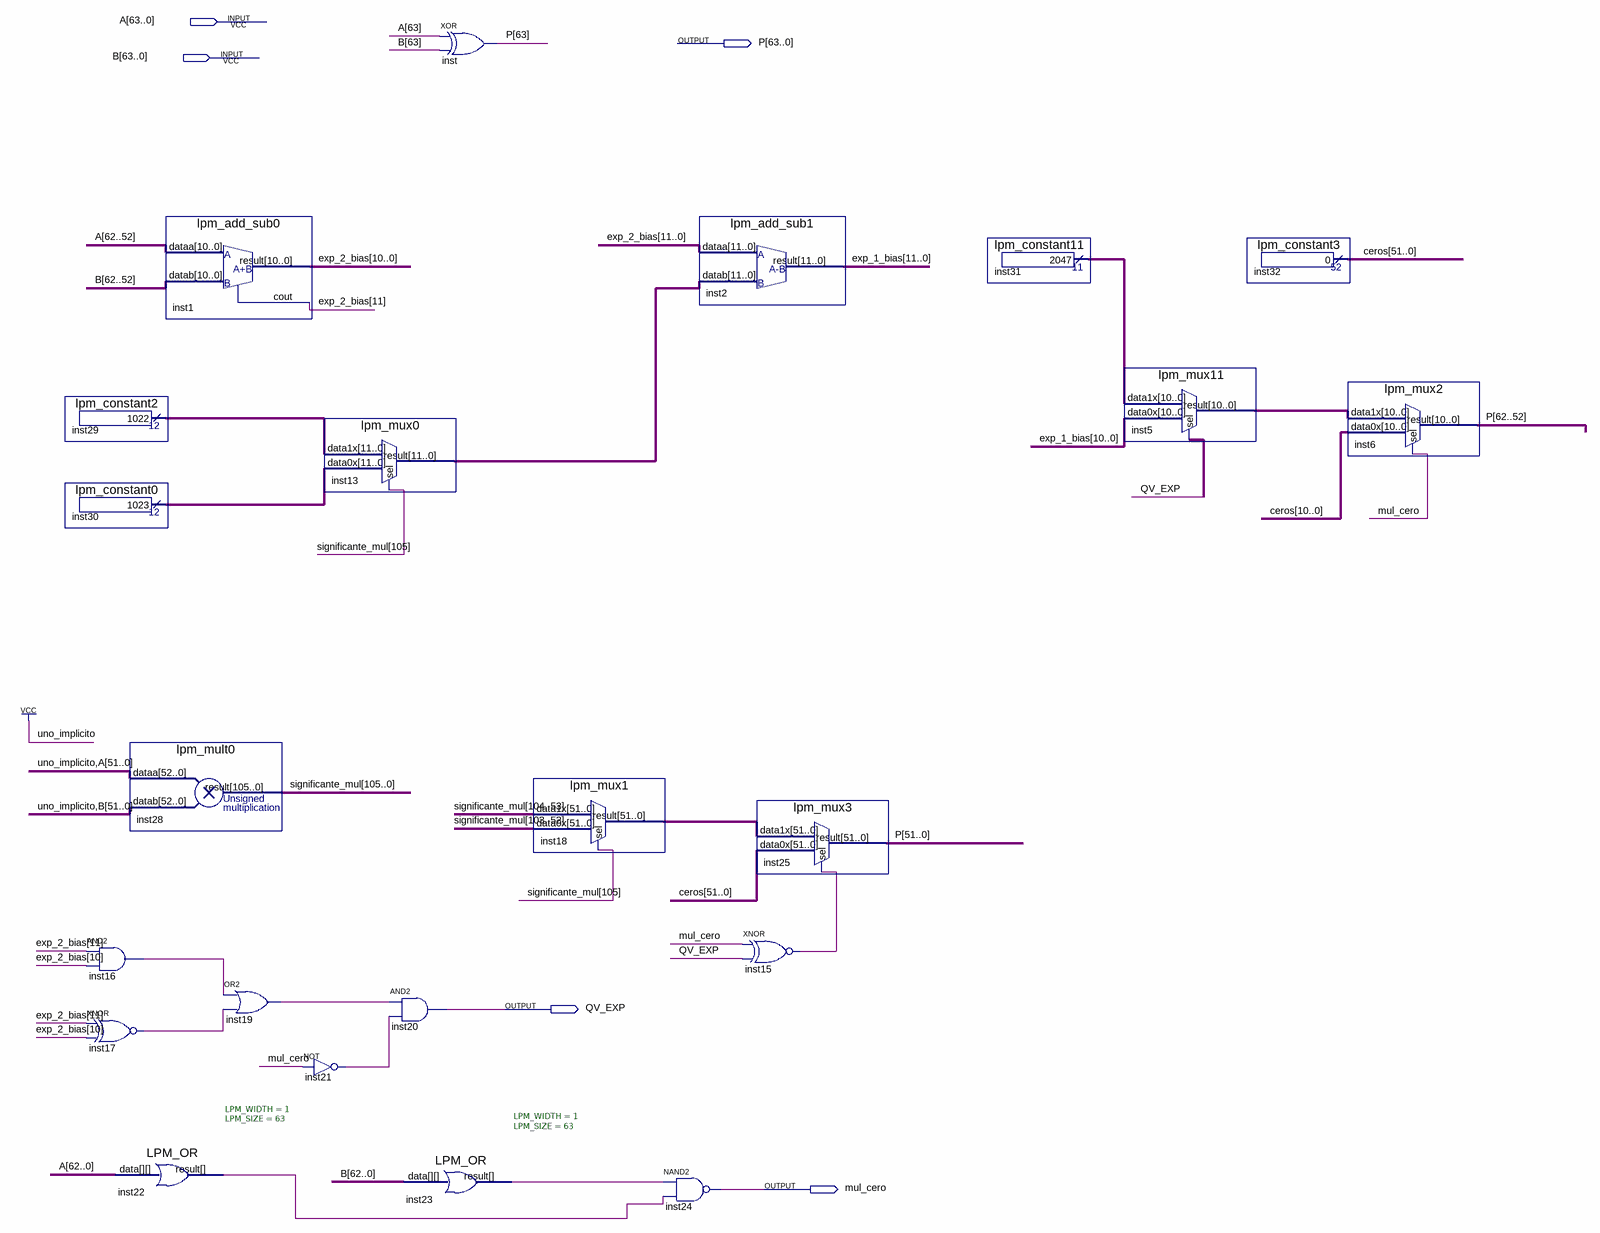
[diagram p0: schematic sheet]
// Quartus schematic multiplicador_combinacional_64bits.bdf as structural Verilog: 22 symbols, 5 pins
module multiplicador_combinacional_64bits (
  input  [63:0] A,
  input  [63:0] B,
  output [63:0] P,
  output QV_EXP,
  output mul_cero
);

  wire inst15_out, inst16_out, inst17_out, inst19_out, inst21_out, inst22_result, inst23_result, undriven;
  wire [10:0] inst5_result, inst31_result;
  wire [11:0] exp_1_bias, exp_2_bias, inst13_result, inst29_result, inst30_result;
  wire [51:0] ceros, inst18_result;
  wire [105:0] significante_mul;

  lpm_constant2 inst29 (.result(inst29_result));
  lpm_constant0 inst30 (.result(inst30_result));
  and inst16 (inst16_out, exp_2_bias[11], exp_2_bias[10]);
  xnor inst17 (inst17_out, exp_2_bias[11], exp_2_bias[10]);
  lpm_mult0 inst28 (.dataa({1'b1, A[51:0]}), .datab({1'b1, B[51:0]}), .result(significante_mul));
  LPM_OR #(.LPM_WIDTH(1), .LPM_SIZE(63)) inst22 (.data(A[62:0]), .result(inst22_result));
  lpm_add_sub0 inst1 (.dataa(A[62:52]), .datab(B[62:52]), .result(exp_2_bias[10:0]), .cout(exp_2_bias[11]));
  or inst19 (inst19_out, inst16_out, inst17_out);
  lpm_mux0 inst13 (.data1x(inst29_result), .data0x(inst30_result), .sel(significante_mul[105]), .result(inst13_result));
  not inst21 (inst21_out, mul_cero);
  xor inst (P[63], A[63], B[63]);
  and inst20 (QV_EXP, inst19_out, inst21_out);
  LPM_OR #(.LPM_WIDTH(1), .LPM_SIZE(63)) inst23 (.data(B[62:0]), .result(inst23_result));
  lpm_mux1 inst18 (
    .data1x(significante_mul[104:53]), .data0x(significante_mul[103:52]), .sel(significante_mul[105]),
    .result(inst18_result));
  nand inst24 (mul_cero, inst23_result, inst22_result);
  lpm_add_sub1 inst2 (.dataa(exp_2_bias), .datab(inst13_result), .result(exp_1_bias));
  lpm_mux3 inst25 (.data1x(inst18_result), .data0x(ceros), .sel(inst15_out), .result(P[51:0]));
  xnor inst15 (inst15_out, mul_cero, QV_EXP);
  lpm_constant11 inst31 (.result(inst31_result));
  lpm_mux11 inst5 (.data1x(inst31_result), .data0x(exp_1_bias[10:0]), .sel(undriven), .result(inst5_result));
  lpm_constant3 inst32 (.result(ceros));
  lpm_mux2 inst6 (.data1x(inst5_result), .data0x(ceros[10:0]), .sel(mul_cero), .result(P[62:52]));
endmodule
